# EAGLE design MAU2 (EAGLE 9.1.0)
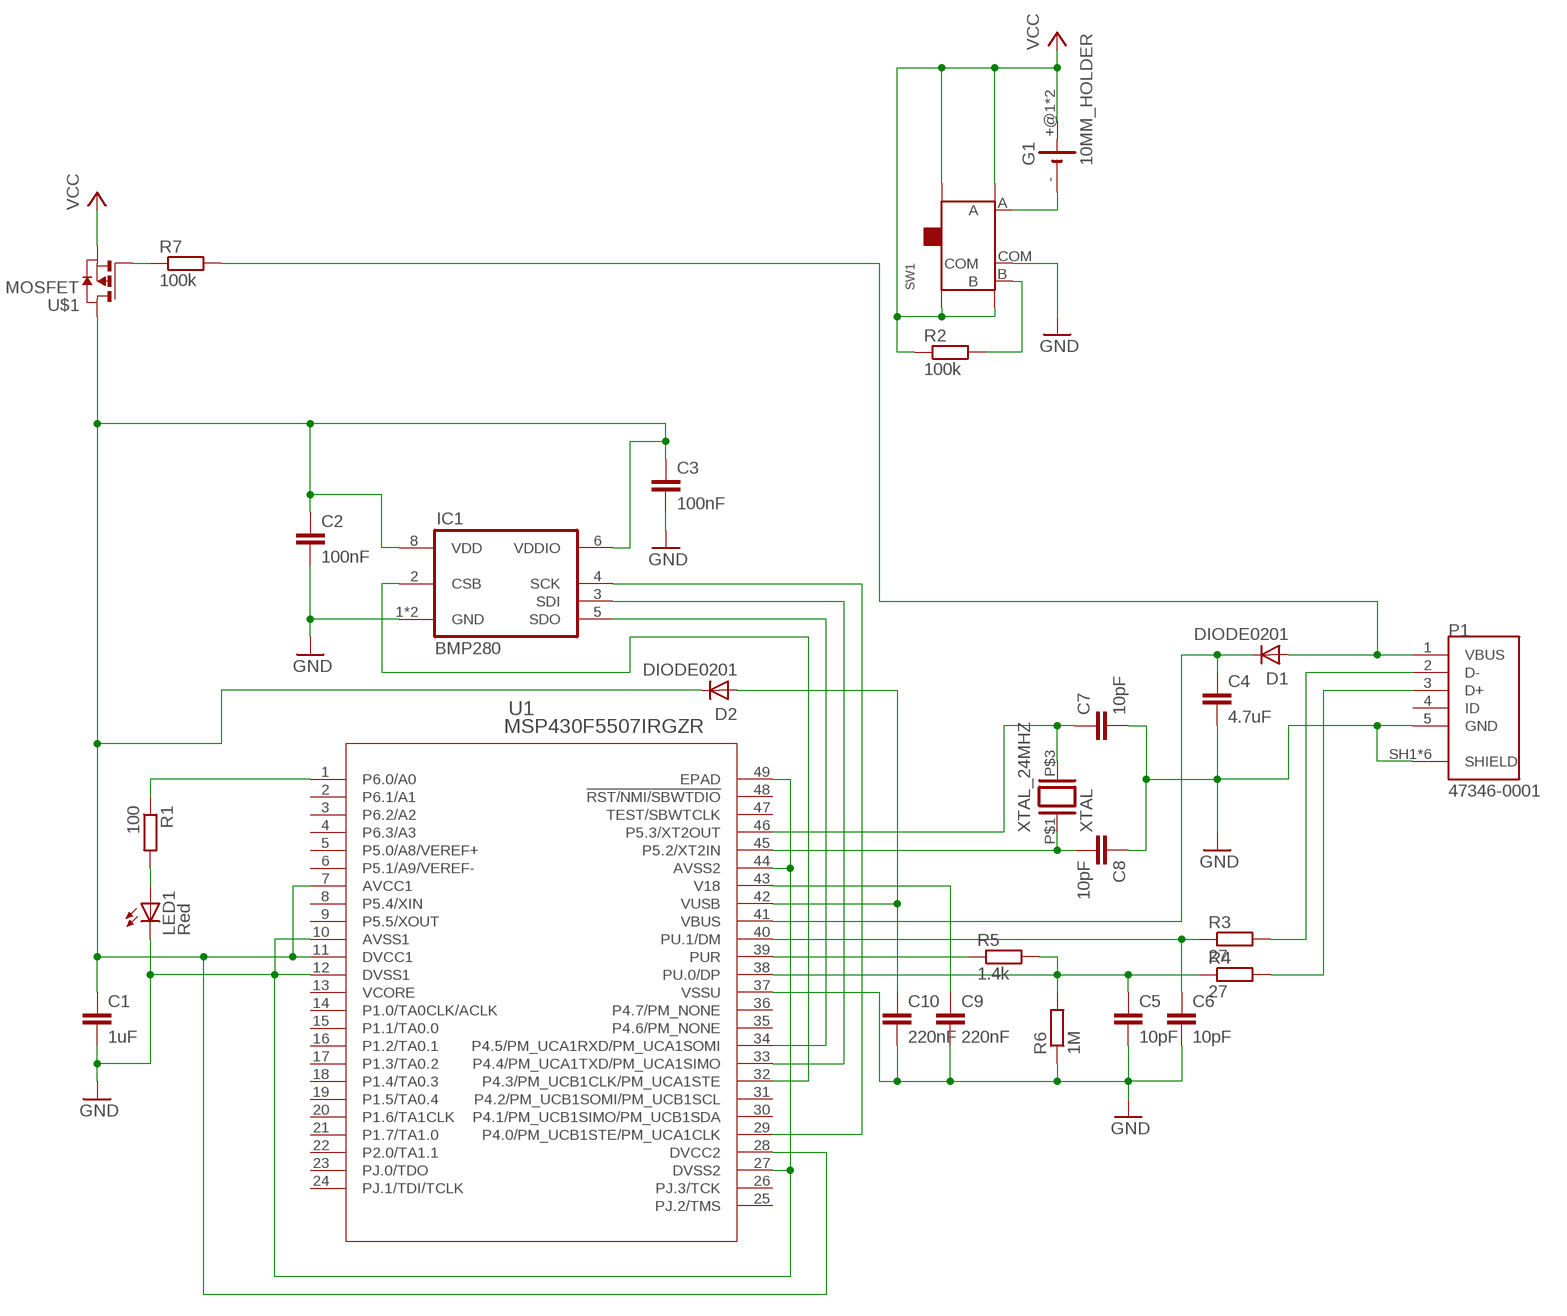
[diagram p0: schematic, sheet 1]

## Parts
C1  1uF  C-EUC0201  [C0201]
C2  100nF  C-EUC0201  [C0201]
C3  100nF  C-EUC0201  [C0201]
C4  4.7uF  C-EUC0201  [C0201]
C5  10pF  C-EUC0201  [C0201]
C6  10pF  C-EUC0201  [C0201]
C7  10pF  C-EUC0201  [C0201]
C8  10pF  C-EUC0201  [C0201]
C9  220nF  C-EUC0201  [C0201]
C10  220nF  C-EUC0201  [C0201]
D1  DIODE0201  [0201]
D2  DIODE0201  [0201]
G1  10MM_HOLDER  [10MM_HOLDER]
IC1  BMP280  [BMP280]
LED1  Red  LEDCHIPLED_0603  [CHIPLED_0603]
P1  47346-0001  [MOLEX_47346-0001]
R1  100  R-EU_R0201  [R0201]
R2  100k  R-EU_R0201  [R0201]
R3  27  R-EU_R0201  [R0201]
R4  27  R-EU_R0201  [R0201]
R5  1.4k  R-EU_R0201  [R0201]
R6  1M  R-EU_R0201  [R0201]
R7  100k  R-EU_R0201  [R0201]
SW1  SMD-TOGGLE-SWITCH-ON-ON(3+4P-6.7X2.7MM)SLIDE_LATERAL  [SW7-SMD-6.7X2.6X1.4MM-90D]
U1  MSP430F5507IRGZR  [RGZ48_5P15X5P15]
U$1  MOSFET  [VLM0806]
XTAL_24MHZ  XTAL  [XTAL_SMD_1612]

## Nets
GND: C1.2 C2.2 C3.2 C4.2 C5.2 C6.2 C7.2 C8.1 C9.2 C10.2 IC1.1(GND) IC1.7(GND) LED1.C P1.5(GND) P1.SH1(SHIELD) P1.SH2(SHIELD) P1.SH3(SHIELD) P1.SH4(SHIELD) P1.SH5(SHIELD) P1.SH6(SHIELD) R6.1 SW1.COM U1.10(AVSS1) U1.12(DVSS1) U1.27(DVSS2) U1.37(VSSU) U1.44(AVSS2) U1.49(EPAD)
N$1: G1.- SW1.A
N$2: C4.1 D1.1(C) U1.41(VBUS)
N$4: LED1.A R1.2
N$5: C6.1 R3.1 U1.40(PU.1/DM)
N$6: R2.2 SW1.B
N$7: C5.1 R4.1 R5.2 R6.2 U1.38(PU.0/DP)
N$8: P1.2(D-) R3.2
N$9: P1.3(D+) R4.2
N$10: R5.1 U1.39(PUR)
N$11: C8.2 U1.45(P5.2/XT2IN) XTAL_24MHZ.P$1
N$12: C7.1 U1.46(P5.3/XT2OUT) XTAL_24MHZ.P$3
N$13: C9.1 U1.43(V18)
N$14: C10.1 D2.2(A) U1.42(VUSB)
N$15: R7.1 U$1.P$1(G)
N$16: IC1.5(SDO) U1.34(P4.5/PM_UCA1RXD/PM_UCA1SOMI)
N$18: IC1.3(SDI) U1.33(P4.4/PM_UCA1TXD/PM_UCA1SIMO)
N$19: IC1.4(SCK) U1.29(P4.0/PM_UCB1STE/PM_UCA1CLK)
N$20: IC1.2(CSB) U1.32(P4.3/PM_UCB1CLK/PM_UCA1STE)
N$21: R1.1 U1.1(P6.0/A0)
N$22: D1.2(A) P1.1(VBUS) R7.2
VCC: G1.+@1(+) G1.+@2(+) R2.1 SW1.P1(SS4) SW1.P2(SS3) SW1.P3(SS2) SW1.P4(SS1) U$1.P$2(S)
VCC-FET: C1.1 C2.1 C3.1 D2.1(C) IC1.6(VDDIO) IC1.8(VDD) U1.7(AVCC1) U1.11(DVCC1) U1.28(DVCC2) U$1.P$3(D)
Unconnected: P1.4(ID) U1.2(P6.1/A1) U1.3(P6.2/A2) U1.4(P6.3/A3) U1.5(P5.0/A8/VEREF+) U1.6(P5.1/A9/VEREF-) U1.8(P5.4/XIN) U1.9(P5.5/XOUT) U1.14(P1.0/TA0CLK/ACLK) U1.15(P1.1/TA0.0) U1.16(P1.2/TA0.1) U1.17(P1.3/TA0.2) U1.18(P1.4/TA0.3) U1.19(P1.5/TA0.4) U1.20(P1.6/TA1CLK) U1.21(P1.7/TA1.0) U1.22(P2.0/TA1.1) U1.23(PJ.0/TDO) U1.24(PJ.1/TDI/TCLK) U1.25(PJ.2/TMS) U1.26(PJ.3/TCK) U1.30(P4.1/PM_UCB1SIMO/PM_UCB1SDA) U1.31(P4.2/PM_UCB1SOMI/PM_UCB1SCL) U1.35(P4.6/PM_NONE) U1.36(P4.7/PM_NONE) U1.47(TEST/SBWTCLK) U1.48(!RST/NMI/SBWTDIO)

## Power pins joined to a net without a drawn wire
VCORE: U1.13(VCORE)

## Library data of the parts
C1-C10 = rcl:C-EU: CAPACITOR, European symbol; SPICEPREFIX: C
D1 D2 = GenericComponents:DIODE: A general purpose Diode
G1 = battery:10MM_HOLDER: Battery cell clip for CR927 Source: KEYSTONE ELECTRONICS CORP. www.keyelco.com, ASTORIA, N.Y. 11105-2017 PART ANME 10mm SM COIN CELl CLIP DWG NO. 3030
IC1 = bosch-bmp280:BMP280: The BMP280 is an absolute barometric pressure sensor especially designed for mobile applications. The sensor module is housed in an extremely compact 8-pin metal-lid LGA package with a footprint of only 2.0 × 2.5 mm2 and 0.95 mm package height. Its small dimensions and its low power consumption of 2.7 μA @1Hz allow the implementation in battery driven devices such as mobile phones, GPS modules or watches. The library has been designed by Richard Magdycz <https://www.facebook.com/groups/eaglecadsoftUK>
LED1 = led:LED: LED OSRAM: - CHIPLED LG R971, LG N971, LY N971, LG Q971, LY Q971, LO R971, LY R971 LH N974, LH R974 LS Q976, LO Q976, LY Q976 LO Q996 - Hyper CHIPLED LW Q18S LB Q993, LB Q99A, LB R99A - SideLED LS A670, LO A670, LY A670, LG A670, LP A670 LB A673, LV A673, LT A673, LW A673 LH A674 LY A675 LS A676, LA A676, LO A676, LY A676, LW A676 LS A679, LY A679, LG A679 - Hyper Micro SIDELED® LS Y876, LA Y876, LO Y876, LY Y876 LT Y87S - SmartLED LW L88C, LW L88S LB L89C, LB L89S, LG L890 LS L89K, LO L89K, LY L89K LS L896, LA L896, LO L896, LY L896 - TOPLED LS T670, LO T670, LY T670, LG T670, LP T670 LSG T670, LSP T670, LSY T670, LOP T670, LYG T670 LG T671, LOG T671, LSG T671 LB T673, LV T673, LT T673, LW T673 LH T674 LS T676, LA T676, LO T676, LY T676, LB T676, LH T676, LSB T676, LW T676 LB T67C, LV T67C, LT T67C, LS T67K, LO T67K, LY T67K, LW E67C LS E67B, LA E67B, LO E67B, LY E67B, LB E67C, LV E67C, LT E67C LW T67C LS T679, LY T679, LG T679 LS T770, LO T770, LY T770, LG T770, LP T770 LB T773, LV T773, LT T773, LW T773 LH T774 LS E675, LA E675, LY E675, LS T675 LS T776, LA T776, LO T776, LY T776, LB T776 LHGB T686 LT T68C, LB T68C - Hyper Mini TOPLED® LB M676 - Mini TOPLED Santana® LG M470 LS M47K, LO M47K, LY M47K Source: http://www.osram.convergy.de LUXEON: - LUMILED® LXK2-PW12-R00, LXK2-PW12-S00, LXK2-PW14-U00, LXK2-PW14-V00 LXK2-PM12-R00, LXK2-PM12-S00, LXK2-PM14-U00 LXK2-PE12-Q00, LXK2-PE12-R00, LXK2-PE12-S00, LXK2-PE14-T00, LXK2-PE14-U00 LXK2-PB12-K00, LXK2-PB12-L00, LXK2-PB12-M00, LXK2-PB14-N00, LXK2-PB14-P00, LXK2-PB14-Q00 LXK2-PR12-L00, LXK2-PR12-M00, LXK2-PR14-Q00, LXK2-PR14-R00 LXK2-PD12-Q00, LXK2-PD12-R00, LXK2-PD12-S00 LXK2-PH12-R00, LXK2-PH12-S00 LXK2-PL12-P00, LXK2-PL12-Q00, LXK2-PL12-R00 Source: www.luxeon.com KINGBRIGHT: KA-3528ASYC Source: www.kingbright.com
P1 = MicroUSB:47346-0001: CONN RCPT 5POS MICRO USB R/A SMD; AVAILABILITY: Unavailable; DESCRIPTION: Micro-USB B Receptacle with Flange, Bottom Mount, SMT, Lead-Free; MF: Molex; MP: 47346-0001; PACKAGE: None; PRICE: None
R1-R7 = rcl:R-EU_: RESISTOR, European symbol; SPICEPREFIX: R
SW1 = altimeter:SMD-TOGGLE-SWITCH-ON-ON(3+4P-6.7X2.7MM): 311030001
U1 = Texas Instruments MCUs:MSP430F5507IRGZR; MANUFACTURER_PART_NUMBER: MSP430F5507IRGZR; VENDOR: Texas Instruments
U$1 = GenericComponents:MOSFET
XTAL_24MHZ = GenericComponents:XTAL

## Board
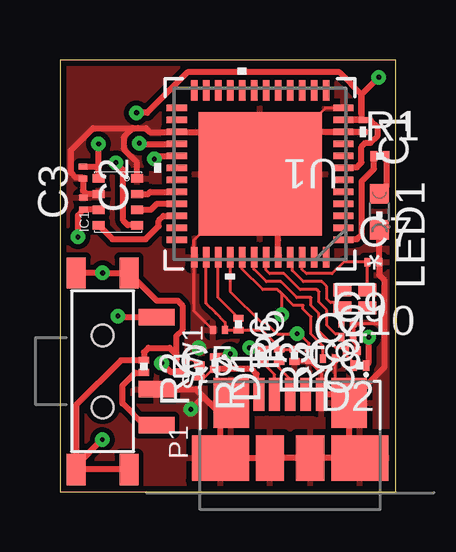
[diagram p1: board, top side]
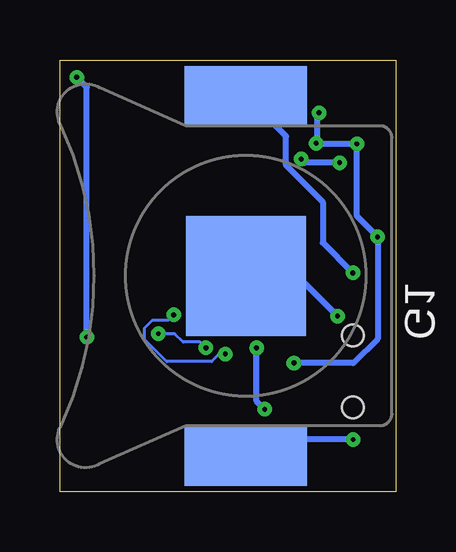
[diagram p2: board, bottom side, seen from below]

Size 14 x 18 mm. Coordinates in mm from the lower left corner, seen from the top.
Outline: 0,0 14,0 14,18 0,18 0,0
Copper layers (1*16): Top 0.035mm / dielectric 1.5mm / Bottom 0.035mm
Design rules "default *": minimum track width 1mil, minimum drill 0.2mm, track to track 8mil, track to pad 8mil, pad to pad 8mil, via to via 8mil, smd to smd 8mil, copper to edge 10mil, drill to drill 8mil, minimum pad ring 10mil, minimum via ring 8mil, stop-mask expansion 4mil, vias tented up to drill 0mil, thermal gap 10mil

### Footprints (pad centres in the part's own frame; a part is rotated, then mirrored left to right if it is on the bottom)
C0201 = smd 0.25 x 0.35: 1 -0.25,0; 2 0.25,0
0201 = smd 0.28 x 0.43: 1 -0.255,0; 2 0.255,0
10MM_HOLDER = smd 2.5 x 5.1 bottom: +@1 -7.5,0; +@2 7.5,0 | smd 5 x 5 bottom: - 0,0
BMP280 = smd 0.35 x 0.5: 1 0.975,-0.8; 2 0.325,-0.8; 3 -0.325,-0.8; 4 -0.975,-0.8; 5 -0.975,0.8; 6 -0.325,0.8; 7 0.325,0.8; 8 0.975,0.8
CHIPLED_0603 = smd 0.8 x 0.8: A 0,-0.75; C 0,0.75
MOLEX_47346-0001 = smd 0.45 x 1.38: 1 -1.3,2.66; 2 -0.65,2.66; 3 0,2.66; 4 0.65,2.66; 5 1.3,2.66 | smd 1.475 x 2.1: SH1 -2.462,2.3; SH2 2.462,2.3 | smd 2.375 x 1.9: SH3 -2.913,0; SH6 2.913,0 | smd 1.175 x 1.9: SH4 -0.838,0; SH5 0.838,0
R0201 = smd 0.28 x 0.43: 1 -0.255,0; 2 0.255,0
SW7-SMD-6.7X2.6X1.4MM-90D = smd 0.7 x 1.5: A -2.25,2.25; B 2.25,2.25; COM 0.75,2.25 | smd 1.3 x 0.8: P1 -4.1,1.1; P2 -4.1,-1.1; P3 4.1,-1.1; P4 4.1,1.1 | hole 0.9: -1.5,0; 1.5,0
RGZ48_5P15X5P15 = smd 0.85 x 0.28: 1 -3.475,2.75; 2 -3.475,2.25; 3 -3.475,1.75; 4 -3.475,1.25; 5 -3.475,0.75; 6 -3.475,0.25; 7 -3.475,-0.25; 8 -3.475,-0.75; 9 -3.475,-1.25; 10 -3.475,-1.75; 11 -3.475,-2.25; 12 -3.475,-2.75; 25 3.475,-2.75; 26 3.475,-2.25; 27 3.475,-1.75; 28 3.475,-1.25; 29 3.475,-0.75; 30 3.475,-0.25; 31 3.475,0.25; 32 3.475,0.75; 33 3.475,1.25; 34 3.475,1.75; 35 3.475,2.25; 36 3.475,2.75 | smd 0.28 x 0.85: 13 -2.751,-3.475; 14 -2.251,-3.475; 15 -1.75,-3.475; 16 -1.25,-3.475; 17 -0.75,-3.475; 18 -0.25,-3.475; 19 0.25,-3.475; 20 0.75,-3.475; 21 1.25,-3.475; 22 1.75,-3.475; 23 2.251,-3.475; 24 2.751,-3.475; 37 2.751,3.475; 38 2.251,3.475; 39 1.75,3.475; 40 1.25,3.475; 41 0.75,3.475; 42 0.25,3.475; 43 -0.25,3.475; 44 -0.75,3.475; 45 -1.25,3.475; 46 -1.75,3.475; 47 -2.251,3.475; 48 -2.751,3.475 | smd 5.15 x 5.15: 49 0,0
VLM0806 = smd 0.2 x 0.28: P$1 -0.21,-0.25; P$2 0.21,-0.25 | smd 0.6 x 0.3: P$3 0,0.25
XTAL_SMD_1612 = smd 0.75 x 0.54: P$1 -0.525,-0.375; P$2 0.525,-0.375; P$3 0.525,0.375; P$4 -0.525,0.375

### Placement (x,y rotation side)
C1  12.65,15.25 270 top
C2  0.97,13.31 270 top
C3  0.98,12.01 90 top
C4  11.21,5.55 0 top
C5  6.64,6.74 180 top
C6  10.39,5.69 270 top
C7  13.07,9.57 0 top
C8  11.98,7.01 180 top
C9  11.99,6.44 0 top
C10  12.17,5.88 0 top
D1  6.47,5.36 270 top
D2  12.51,5.25 180 top
G1  6.25,9 90 top
IC1  2.42,12.08 90 top
LED1  13.33,11.67 180 top
P1  9.6,1.4 0 top
R1  13.35,13.99 0 top
R2  3.5,5.22 270 top
R3  8.49,5.68 270 top
R4  9.14,5.68 270 top
R5  7.45,6.98 270 top
R6  9.78,5.68 90 top
R7  5.81,5.03 270 top
SW1  1.78,5.02 270 top
U1  8.35,13.25 180 top
U$1  5.07,5.23 180 top
XTAL_24MHZ  12.3,8.04 0 top

### Tracks (layer width: path | path; a pad name or v marks a point on that pad's centre or on a via)
GND  (via drill 0.2)
  Top 0.127: U1.49 5.6,10.5 U1.37 5.6,7.53 C5.2 | C8.1 C9.2 12.24,6.24 12.41,6.07 C10.2 | P1.5 10.9,4.93 C6.2 10.38,5.42 R6.1 | C4.2 11.46,4.3 P1.SH2 | U1.12 11.07,15.99 10.23,15.16 10.23,15 | C8.1 12.27,7.05 | C8.1 13.49,7.01 13.53,7.05
  Top 0.254: 10.23,15 U1.10 C1.2 | 10.23,15 10.1,15 | 3.05,15.16 2.68,14.79 2.68,14.27 3.22,13.73 IC1.1 | 3.05,15.16 3.24,15.16 | 3.24,15.16 3.58,15.16 3.74,15 U1.27 6.6,15 U1.49 | IC1.7 1.12,12.4 | 1.12,12.4 C3.2 | 1.12,12.4 0.97,12.56 C2.2 0.92,13.1 0.66,13.1 0.46,13.3 0.46,14.25 1.38,15.16 3.05,15.16 | 3.05,15.16 3.24,15.16 | P1.SH5 10.22,1.4 | 10.22,1.4 P1.SH4 P1.SH3 6.69,3.25 | 10.22,1.4 P1.SH6 12.06,1.85 P1.SH2 | P1.SH2 11.7,4.06 P1.5 | 6.69,3.25 P1.SH1 7.14,3.94 | 5.98,3.96 5.67,4.27 SW1.COM | 5.98,3.96 6.69,3.25 | P1.SH2 13.53,5.17 13.53,7.05 13.53,8.82 13.32,9.03 C7.2 LED1.C | U1.44 9.1,10.47 | 9.1,10.47 9.1,12.5 U1.49 | 9.1,10.47 | U1.49 10.1,15 | 10.1,15 10.23,15 | v5.46,3.43 5.98,3.95 5.98,3.96
  Bottom 0.254: v5.46,3.43 5.8,3.77 v5.8,5.99
  pour Top: 0,-0.02 0,17.98 13.99,17.98 13.99,0.02 0.05,0.02 0,-0.03
N$1  (via drill 0.2)
  Top 0.254: SW1.A 2.46,7.27 v2.42,7.32
  Bottom 0.254: v2.42,7.32 4.1,9 G1.-
N$2  (via drill 0.2)
  Top 0.127: C4.1 10.96,6.08 10.47,6.57 10.47,7.28 10.14,7.61 10.14,7.76 9.74,7.76 9.23,8.27 | U1.41 7.6,9.29 8.47,8.42 9.08,8.42 9.23,8.27 | D1.1 6.59,5.74 v7.1,5.74 | v9.26,7.37 9.26,8.25 9.23,8.27
  Bottom 0.127: v7.1,5.74 7.36,5.74 7.67,5.42 9.55,5.42 10.47,6.34 10.47,6.82 10.14,7.15 9.47,7.15 v9.26,7.37
N$4
  Top 0.254: R1.2 13.61,12.7 LED1.A
N$5  (via drill 0.2)
  Top 0.127: C6.1 10.39,6.18 10.14,6.43 10.14,6.57 10.13,6.58 v9.9,6.58 9.05,6.58 8.58,7.05 8.4,7.05 7.1,8.35 U1.40 | R3.1 7.97,5.93 v7.91,5.99
  Bottom 0.127: v7.91,5.99 8.15,6.23 8.86,6.23 9.21,6.58 v9.9,6.58
N$6
  Top 0.254: SW1.B 3.51,2.77 2.61,3.67 2.61,4.42 3.14,4.95 3.48,4.95 R2.2
N$7
  Top 0.127: R6.2 R4.1 9.14,6.03 8.44,6.72 R5.2 7.43,6.74 C5.1 6.89,7.06 6.5,7.45 6.1,7.85 U1.38
N$8
  Top 0.127: R3.2 8.66,5.26 8.66,5.17 8.95,4.88 P1.2
N$9
  Top 0.127: P1.3 9.6,4.7 9.14,5.16 R4.2
N$10
  Top 0.127: R5.1 6.6,8.09 U1.39
N$11
  Top 0.127: C8.2 11.73,7.62 XTAL_24MHZ.P$1 11.56,7.88 11.29,7.88 11.13,8.04 11.13,8.55 10.93,8.75 10.15,8.75 9.69,9.21 9.69,9.68 U1.45
N$12
  Top 0.127: XTAL_24MHZ.P$3 C7.1 11.84,9.57 11.35,9.08 10.29,9.08 10.1,9.27 U1.46
  Top 0.254: C7.1
N$13
  Top 0.127: C9.1 11.61,6.57 11.49,6.57 11.13,6.93 11.13,7.57 10.8,7.9 10.8,8.33 10.71,8.42 10.01,8.42 9.35,9.08 8.75,9.08 8.6,9.23 U1.43
  Top 0.254: U1.43
N$14
  Top 0.127: U1.42 8.09,9.77 8.09,9.27 8.61,8.75 9.22,8.75 9.88,8.09 10.47,8.09 10.47,7.76 10.8,7.43 10.8,6.7 11.51,6 11.8,6 C10.1 11.92,5.71 12.26,5.37 D2.2
N$15
  Top 0.127: U$1.P$1 5.54,5.48 5.74,5.29 R7.1
N$16
  Top 0.254: IC1.5 2.2,10.53 3.58,10.53 4.12,11.07 4.12,11.3 4.32,11.5 U1.34
N$18
  Top 0.254: U1.33 4.04,12.01 3.79,11.76 IC1.3
N$19  (via drill 0.2)
  Top 0.254: IC1.4 2.83,11.11 2.64,11.29 2.64,13.41 v2.33,13.71 | v3.94,13.87 4.07,14 U1.29
  Bottom 0.254: v2.33,13.71 3.78,13.71 v3.94,13.87
N$20
  Top 0.254: U1.32 3.76,12.5 3.67,12.4 IC1.2
N$21
  Top 0.254: U1.1 11.86,10.53 12.39,10.53 12.59,10.73 12.59,12.95 13.1,13.46 R1.1
N$22
  Top 0.127: R7.2 6.05,4.78 6.29,5.02 6.38,5.02 D1.2
  Top 0.254: P1.1 8.21,4.16 8.21,4.89 7.99,5.11 D1.2
VCC  (via drill 0.2)
  Top 0.254: SW1.P3 0.68,1.08 | SW1.P4 SW1.P3 | SW1.P2 v1.78,9.12 SW1.P1 4.05,7.95 4.92,7.95 5.11,7.76 5.11,6.75 4.85,6.49 4.85,5.71 4.76,5.8 4.76,5.81 | SW1.P3 0.68,1.08 | U$1.P$2 4.86,5.71 4.76,5.81 | 4.76,5.81 4.58,5.99 3.69,5.99 3.5,5.8 R2.1 2.54,5.47 0.68,3.61 SW1.P3 | v1.77,2.17 0.68,1.08 | 0.68,1.08 SW1.P3
  Bottom 0.254: v1.77,2.17 5.58,2.17 G1.+@1 | G1.+@2 4.57,14.82 4.57,13.6 3.04,12.07 3.04,10.38 v1.78,9.12
VCC-FET  (via drill 0.2)
  Top 0.254: 1.62,13.52 v1.62,14.49 v1.61,14.5 | 3.34,14.5 v3.31,14.53 3.34,14.5 | IC1.6 C3.1 | C3.1 | C2.1 1.58,13.56 1.62,13.52 | v0.75,10.62 0.75,11.53 C3.1 | U1.7 11.86,13.53 12.39,13.53 12.58,13.72 12.58,14.38 12.74,14.54 12.96,14.54 13.25,14.83 13.25,15.2 12.95,15.5 C1.1 U1.11 11.86,15.53 12.58,15.53 12.58,15.72 | v3.19,15.8 3.64,15.8 5.32,17.48 11.66,17.48 12.58,16.56 12.58,15.72 | v4.24,5.36 4.62,4.98 U$1.P$3 | D2.1 12.88,5.37 v12.88,6.44 | v13.3,17.28 12.58,16.56 12.58,15.72 | 3.34,14.5 U1.28 | IC1.8 1.62,13.52
  Bottom 0.254: 3.28,14.5 v1.61,14.5 1.61,11.48 v0.75,10.62 0.75,6.38 1.76,5.36 v4.24,5.36 | 3.28,14.5 v3.31,14.53 | v3.19,15.8 3.28,15.71 3.28,14.5 | v12.88,6.44 12.88,16.86 v13.3,17.28